# EAGLE design Hviezdy (EAGLE 7.5.0)
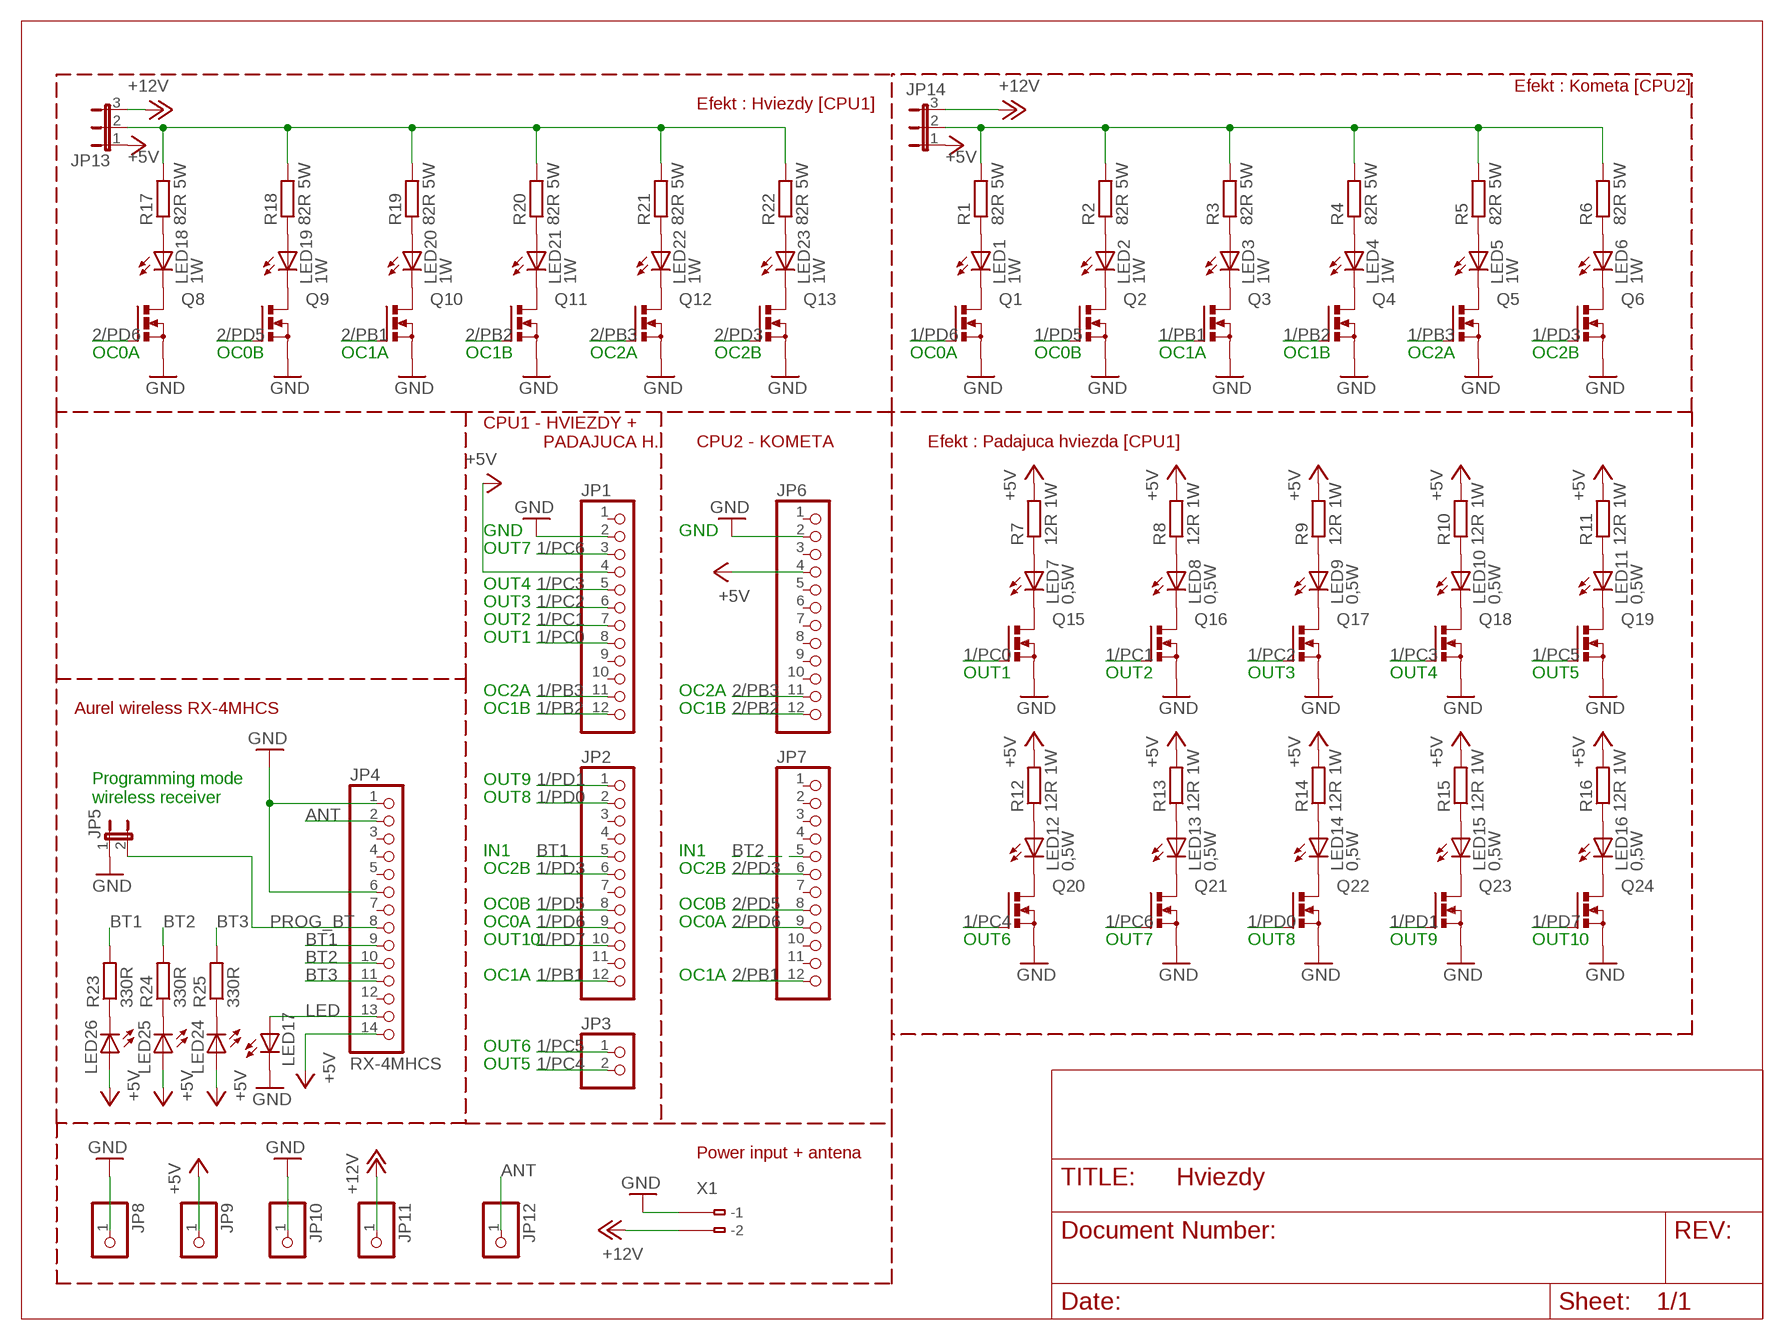
[diagram p0: schematic, sheet 1]

## Parts
JP1  PINHD-1X12  [1X12]
JP2  PINHD-1X12  [1X12]
JP3  PINHD-1X2  [1X02]
JP4  RX-4MHCS  PINHD-1X14  [1X14]
JP5  JP1E  [JP1]
JP6  PINHD-1X12  [1X12]
JP7  PINHD-1X12  [1X12]
JP8  PINHD-1X1  [1X01]
JP9  PINHD-1X1  [1X01]
JP10  PINHD-1X1  [1X01]
JP11  PINHD-1X1  [1X01]
JP12  PINHD-1X1  [1X01]
JP13  JP2E  [JP2]
JP14  JP2E  [JP2]
LED1  1W  LED5MM  [LED5MM]
LED2  1W  LED5MM  [LED5MM]
LED3  1W  LED5MM  [LED5MM]
LED4  1W  LED5MM  [LED5MM]
LED5  1W  LED5MM  [LED5MM]
LED6  1W  LED5MM  [LED5MM]
LED7  0,5W  LED10MM  [LED10MM]
LED8  0,5W  LED10MM  [LED10MM]
LED9  0,5W  LED10MM  [LED10MM]
LED10  0,5W  LED10MM  [LED10MM]
LED11  0,5W  LED10MM  [LED10MM]
LED12  0,5W  LED10MM  [LED10MM]
LED13  0,5W  LED10MM  [LED10MM]
LED14  0,5W  LED10MM  [LED10MM]
LED15  0,5W  LED10MM  [LED10MM]
LED16  0,5W  LED10MM  [LED10MM]
LED17  LED3MM  [LED3MM]
LED18  1W  LED5MM  [LED5MM]
LED19  1W  LED5MM  [LED5MM]
LED20  1W  LED5MM  [LED5MM]
LED21  1W  LED5MM  [LED5MM]
LED22  1W  LED5MM  [LED5MM]
LED23  1W  LED5MM  [LED5MM]
LED24  LED3MM  [LED3MM]
LED25  LED3MM  [LED3MM]
LED26  LED3MM  [LED3MM]
Q1  PMOSFET_NTO220BV  [TO220BV]
Q2  PMOSFET_NTO220BV  [TO220BV]
Q3  PMOSFET_NTO220BV  [TO220BV]
Q4  PMOSFET_NTO220BV  [TO220BV]
Q5  PMOSFET_NTO220BV  [TO220BV]
Q6  PMOSFET_NTO220BV  [TO220BV]
Q8  PMOSFET_NTO220BV  [TO220BV]
Q9  PMOSFET_NTO220BV  [TO220BV]
Q10  PMOSFET_NTO220BV  [TO220BV]
Q11  PMOSFET_NTO220BV  [TO220BV]
Q12  PMOSFET_NTO220BV  [TO220BV]
Q13  PMOSFET_NTO220BV  [TO220BV]
Q15  PMOSFET_NTO220BV  [TO220BV]
Q16  PMOSFET_NTO220BV  [TO220BV]
Q17  PMOSFET_NTO220BV  [TO220BV]
Q18  PMOSFET_NTO220BV  [TO220BV]
Q19  PMOSFET_NTO220BV  [TO220BV]
Q20  PMOSFET_NTO220BV  [TO220BV]
Q21  PMOSFET_NTO220BV  [TO220BV]
Q22  PMOSFET_NTO220BV  [TO220BV]
Q23  PMOSFET_NTO220BV  [TO220BV]
Q24  PMOSFET_NTO220BV  [TO220BV]
R1  82R 5W  R-EU_0922V  [0922V]
R2  82R 5W  R-EU_0922V  [0922V]
R3  82R 5W  R-EU_0922V  [0922V]
R4  82R 5W  R-EU_0922V  [0922V]
R5  82R 5W  R-EU_0922V  [0922V]
R6  82R 5W  R-EU_0922V  [0922V]
R7  12R 1W  R-EU_0309/12  [0309/12]
R8  12R 1W  R-EU_0309/12  [0309/12]
R9  12R 1W  R-EU_0309/12  [0309/12]
R10  12R 1W  R-EU_0309/12  [0309/12]
R11  12R 1W  R-EU_0309/12  [0309/12]
R12  12R 1W  R-EU_0309/12  [0309/12]
R13  12R 1W  R-EU_0309/12  [0309/12]
R14  12R 1W  R-EU_0309/12  [0309/12]
R15  12R 1W  R-EU_0309/12  [0309/12]
R16  12R 1W  R-EU_0309/12  [0309/12]
R17  82R 5W  R-EU_0922V  [0922V]
R18  82R 5W  R-EU_0922V  [0922V]
R19  82R 5W  R-EU_0922V  [0922V]
R20  82R 5W  R-EU_0922V  [0922V]
R21  82R 5W  R-EU_0922V  [0922V]
R22  82R 5W  R-EU_0922V  [0922V]
R23  330R  R-EU_0207/12  [0207/12]
R24  330R  R-EU_0207/12  [0207/12]
R25  330R  R-EU_0207/12  [0207/12]
X1  234-202  [234-202]

## Nets
1/PB1: JP2.12 Q3.G
1/PB2: JP1.12 Q4.G
1/PB3: JP1.11 Q5.G
1/PC0: JP1.8 Q15.G
1/PC1: JP1.7 Q16.G
1/PC2: JP1.6 Q17.G
1/PC3: JP1.5 Q18.G
1/PC4: JP3.2 Q20.G
1/PC5: JP3.1 Q19.G
1/PC6: JP1.3 Q21.G
1/PD0: JP2.2 Q22.G
1/PD1: JP2.1 Q23.G
1/PD3: JP2.6 Q6.G
1/PD5: JP2.8 Q2.G
1/PD6: JP2.9 Q1.G
1/PD7: JP2.10 Q24.G
2/PB1: JP7.12 Q10.G
2/PB2: JP6.12 Q11.G
2/PB3: JP6.11 Q12.G
2/PD3: JP7.6 Q13.G
2/PD5: JP7.8 Q9.G
2/PD6: JP7.9 Q8.G
+5V: JP1.4 JP4.14 JP6.4 JP9.1 JP13.1 JP14.1 LED24.A LED25.A LED26.A R7.2 R8.2 R9.2 R10.2 R11.2 R12.2 R13.2 R14.2 R15.2 R16.2
+12V: JP11.1 JP13.3 JP14.3 X1.B2(B-2)
ANT: JP4.2 JP12.1
BT1: JP2.5 JP4.9 R23.2
BT2: JP4.10 JP7.5 R24.2
BT3: JP4.11 R25.2
GND: JP1.2 JP4.1 JP4.6 JP5.1 JP6.2 JP8.1 JP10.1 LED17.K(C) Q1.S Q2.S Q3.S Q4.S Q5.S Q6.S Q8.S Q9.S Q10.S Q11.S Q12.S Q13.S Q15.S Q16.S Q17.S Q18.S Q19.S Q20.S Q21.S Q22.S Q23.S Q24.S X1.B1(B-1)
LED: JP4.13 LED17.A
N$1: LED1.K(C) Q1.D
N$2: LED2.K(C) Q2.D
N$3: LED3.K(C) Q3.D
N$4: LED4.K(C) Q4.D
N$5: LED5.K(C) Q5.D
N$6: LED6.K(C) Q6.D
N$7: LED1.A R1.1
N$8: LED2.A R2.1
N$9: LED3.A R3.1
N$10: LED4.A R4.1
N$11: LED5.A R5.1
N$12: LED6.A R6.1
N$13: LED7.A R7.1
N$14: LED7.K(C) Q15.D
N$15: LED8.K(C) Q16.D
N$16: LED9.K(C) Q17.D
N$17: LED10.K(C) Q18.D
N$18: LED11.K(C) Q19.D
N$19: LED12.K(C) Q20.D
N$20: LED8.A R8.1
N$21: LED9.A R9.1
N$22: LED10.A R10.1
N$23: LED11.A R11.1
N$24: LED12.A R12.1
N$25: LED13.A R13.1
N$26: LED14.A R14.1
N$27: LED13.K(C) Q21.D
N$28: LED15.A R15.1
N$29: LED14.K(C) Q22.D
N$30: LED16.A R16.1
N$31: LED15.K(C) Q23.D
N$32: LED18.K(C) Q8.D
N$33: LED16.K(C) Q24.D
N$34: LED19.K(C) Q9.D
N$35: LED20.K(C) Q10.D
N$36: LED21.K(C) Q11.D
N$37: LED22.K(C) Q12.D
N$38: LED23.K(C) Q13.D
N$39: LED18.A R17.1
N$40: LED19.A R18.1
N$41: LED20.A R19.1
N$42: LED21.A R20.1
N$43: LED22.A R21.1
N$44: LED23.A R22.1
N$45: LED26.K(C) R23.1
N$46: LED25.K(C) R24.1
N$47: LED24.K(C) R25.1
N$52: JP13.2 R17.2 R18.2 R19.2 R20.2 R21.2 R22.2
N$53: JP14.2 R1.2 R2.2 R3.2 R4.2 R5.2 R6.2
PROG_BT: JP4.8 JP5.2
Unconnected: JP1.1 JP1.9 JP1.10 JP2.3 JP2.4 JP2.7 JP2.11 JP4.3 JP4.4 JP4.5 JP4.7 JP4.12 JP6.1 JP6.3 JP6.5 JP6.6 JP6.7 JP6.8 JP6.9 JP6.10 JP7.1 JP7.2 JP7.3 JP7.4 JP7.7 JP7.10 JP7.11 X1.A1(-1) X1.A2(-2)

## Notes on the sheet
- Efekt : Kometa [CPU2]
- Efekt : Hviezdy [CPU1]
- OC0A | OC0B | OC1A | OC1B | OC2A | OC2B | OC0A | OC0B | OC1A | OC1B | OC2A | OC2B
- CPU1 - HVIEZDY +
              PADAJUCA H.
- CPU2 - KOMETA | Efekt : Padajuca hviezda [CPU1]
- GND | GND
- OUT7
- OUT4
- OUT3
- OUT2
- OUT1
- OUT1 | OUT2 | OUT3 | OUT4 | OUT5
- OC2A | OC2A
- Aurel wireless RX-4MHCS | OC1B | OC1B
- OUT9
- Programming mode
  wireless receiver
- OUT8
- IN1 | IN1
- OC2B | OC2B
- OC0B | OC0B
- OC0A | OC0A
- OUT10 | OUT6 | OUT7 | OUT8 | OUT9 | OUT10
- OC1A | OC1A
- OUT6
- OUT5
- Power input + antena

## Library data of the parts
JP1 JP2 JP6 JP7 = pinhead:PINHD-1X12: PIN HEADER
JP3 = pinhead:PINHD-1X2: PIN HEADER
JP4 = pinhead:PINHD-1X14: PIN HEADER
JP5 = jumper:JP1E: JUMPER
JP8-JP12 = pinhead:PINHD-1X1: PIN HEADER
JP13 JP14 = jumper:JP2E: JUMPER
LED1-LED26 = led:LED: LED OSRAM: - CHIPLED LG R971, LG N971, LY N971, LG Q971, LY Q971, LO R971, LY R971 LH N974, LH R974 LS Q976, LO Q976, LY Q976 LO Q996 - Hyper CHIPLED LW Q18S LB Q993, LB Q99A, LB R99A - SideLED LS A670, LO A670, LY A670, LG A670, LP A670 LB A673, LV A673, LT A673, LW A673 LH A674 LY A675 LS A676, LA A676, LO A676, LY A676, LW A676 LS A679, LY A679, LG A679 - Hyper Micro SIDELED® LS Y876, LA Y876, LO Y876, LY Y876 LT Y87S - SmartLED LW L88C, LW L88S LB L89C, LB L89S, LG L890 LS L89K, LO L89K, LY L89K LS L896, LA L896, LO L896, LY L896 - TOPLED LS T670, LO T670, LY T670, LG T670, LP T670 LSG T670, LSP T670, LSY T670, LOP T670, LYG T670 LG T671, LOG T671, LSG T671 LB T673, LV T673, LT T673, LW T673 LH T674 LS T676, LA T676, LO T676, LY T676, LB T676, LH T676, LSB T676, LW T676 LB T67C, LV T67C, LT T67C, LS T67K, LO T67K, LY T67K, LW E67C LS E67B, LA E67B, LO E67B, LY E67B, LB E67C, LV E67C, LT E67C LW T67C LS T679, LY T679, LG T679 LS T770, LO T770, LY T770, LG T770, LP T770 LB T773, LV T773, LT T773, LW T773 LH T774 LS E675, LA E675, LY E675, LS T675 LS T776, LA T776, LO T776, LY T776, LB T776 LHGB T686 LT T68C, LB T68C - Hyper Mini TOPLED® LB M676 - Mini TOPLED Santana® LG M470 LS M47K, LO M47K, LY M47K Source: http://www.osram.convergy.de LUXEON: - LUMILED® LXK2-PW12-R00, LXK2-PW12-S00, LXK2-PW14-U00, LXK2-PW14-V00 LXK2-PM12-R00, LXK2-PM12-S00, LXK2-PM14-U00 LXK2-PE12-Q00, LXK2-PE12-R00, LXK2-PE12-S00, LXK2-PE14-T00, LXK2-PE14-U00 LXK2-PB12-K00, LXK2-PB12-L00, LXK2-PB12-M00, LXK2-PB14-N00, LXK2-PB14-P00, LXK2-PB14-Q00 LXK2-PR12-L00, LXK2-PR12-M00, LXK2-PR14-Q00, LXK2-PR14-R00 LXK2-PD12-Q00, LXK2-PD12-R00, LXK2-PD12-S00 LXK2-PH12-R00, LXK2-PH12-S00 LXK2-PL12-P00, LXK2-PL12-Q00, LXK2-PL12-R00 Source: www.luxeon.com KINGBRIGHT: KA-3528ASYC Source: www.kingbright.com
Q1-Q6 Q8-Q13 Q15-Q24 = transistor-power:PMOSFET_N: Power MOSFET N-Channel
R1-R22 = rcl:R-EU_: RESISTOR, European symbol
R23-R25 = resistor:R-EU_: RESISTOR, European symbol
X1 = con-wago:234-202: WAGO Cage Clamp; MPN: 234-202; OC_FARNELL: unknown; OC_NEWARK: 28K9091

## Net classes
0 default: width 1.016 mm, drill 1.016 mm, clearance 0.508 mm

## Board
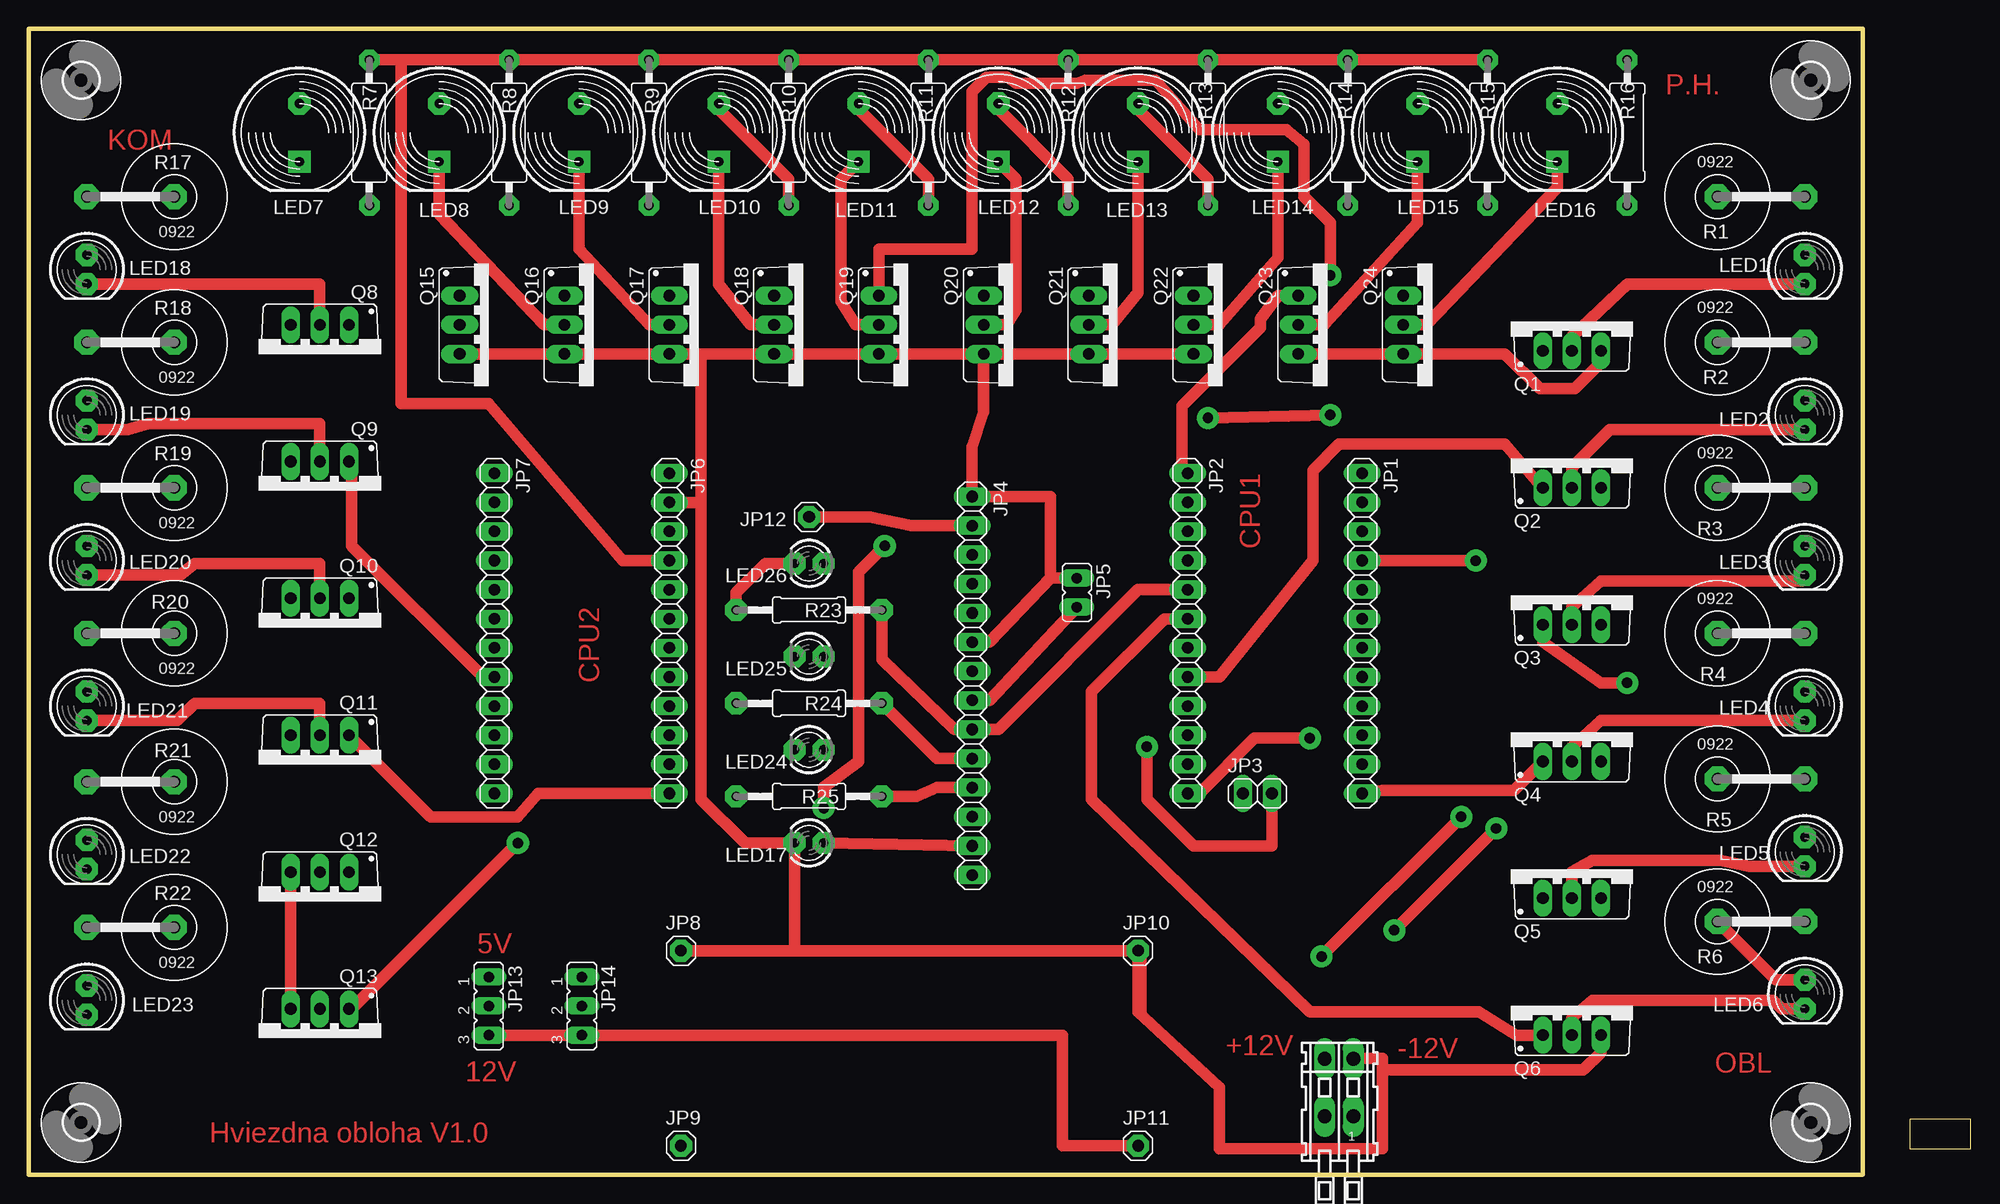
[diagram p1: board, top side]
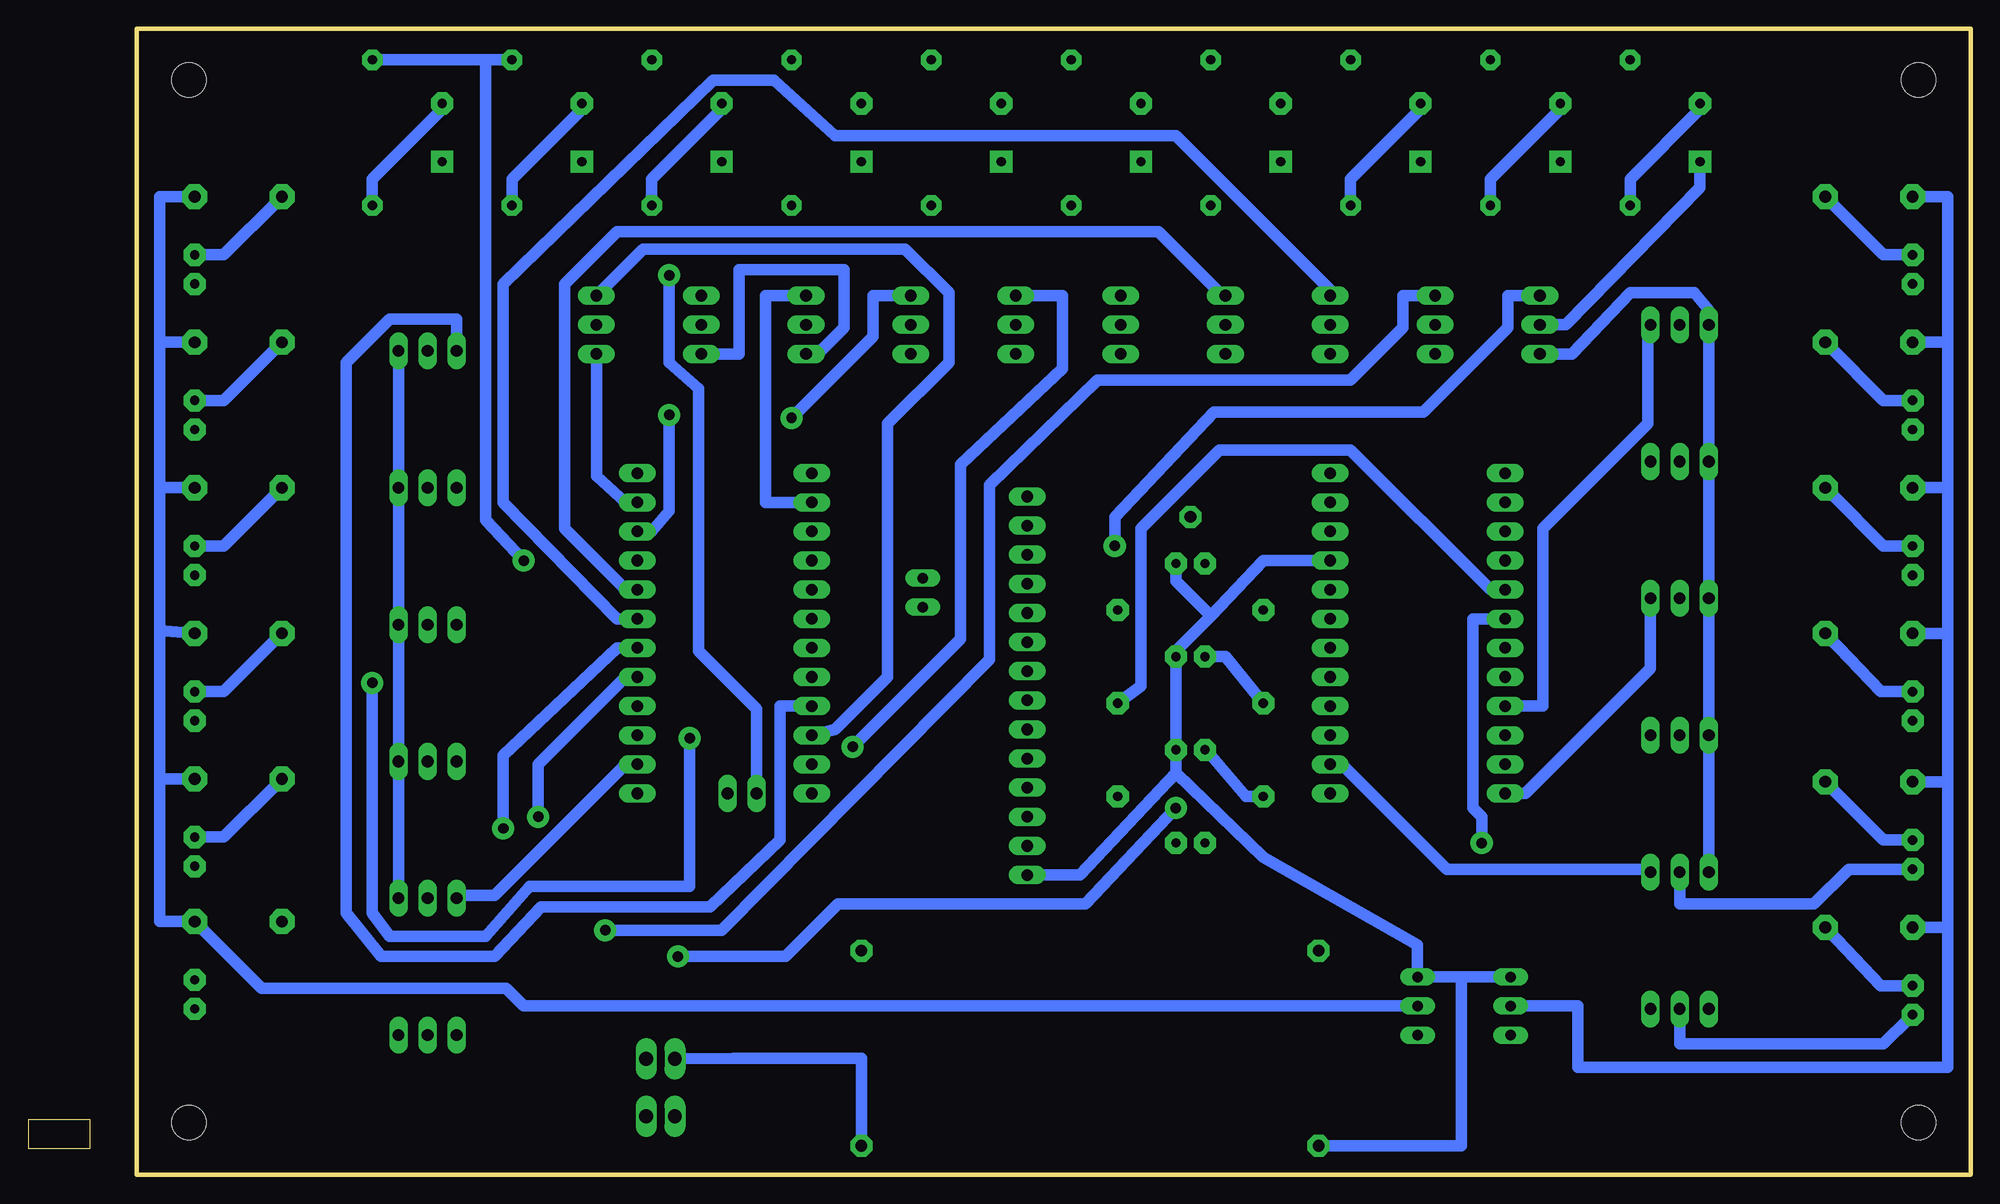
[diagram p2: board, bottom side, seen from below]

Size 169.42 x 100 mm. Coordinates in mm from the lower left corner, seen from the top.
Outline: 0,0 160,0 160,100 0,100 0,0
Copper layers (1*16): Top 0.035mm / dielectric 1.5mm / Bottom 0.035mm
Design rules "default *": minimum track width 10mil, minimum drill 24mil, track to track 8mil, track to pad 8mil, pad to pad 8mil, via to via 8mil, smd to smd 8mil, copper to edge 40mil, drill to drill 8mil, minimum pad ring 12mil, minimum via ring 8mil, stop-mask expansion 4mil, vias tented up to drill 0mil, thermal gap 10mil

### Footprints (pad centres in the part's own frame; a part is rotated, then mirrored left to right if it is on the bottom)
1X12 = drill 1.016 long: 1 -13.97,0; 2 -11.43,0; 3 -8.89,0; 4 -6.35,0; 5 -3.81,0; 6 -1.27,0; 7 1.27,0; 8 3.81,0; 9 6.35,0; 10 8.89,0; 11 11.43,0; 12 13.97,0
1X02 = drill 1.016 long: 1 -1.27,0; 2 1.27,0
1X14 = drill 1.016 long: 1 -16.51,0; 2 -13.97,0; 3 -11.43,0; 4 -8.89,0; 5 -6.35,0; 6 -3.81,0; 7 -1.27,0; 8 1.27,0; 9 3.81,0; 10 6.35,0; 11 8.89,0; 12 11.43,0; 13 13.97,0; 14 16.51,0
JP1 = drill 0.914 long: 1 0,-1.27; 2 0,1.27
1X01 = drill 1.016 pad 1.93 octagon: 1 0,0
JP2 = drill 0.914 long: 1 -2.54,0; 2 0,0; 3 2.54,0
LED5MM = drill 0.813 pad 1.93 octagon: A -1.27,0; K 1.27,0
LED10MM = drill 0.813 pad 1.93 octagon: A -2.54,0 | drill 0.813 pad 1.93 square: K 2.54,0
LED3MM = drill 0.813 pad 1.93 octagon: A -1.27,0; K 1.27,0
TO220BV = drill 1.016 long: D 0,-2.54; G -2.54,-2.54; S 2.54,-2.54
0922V = drill 1.016 pad 2.184 octagon: 1 -5.08,0; 2 2.54,0
0309/12 = drill 0.813 pad 1.778 octagon: 1 -6.35,0; 2 6.35,0
0207/12 = drill 0.813 pad 1.93 octagon: 1 -6.35,0; 2 6.35,0
3,0 = hole 3: 0,0
234-202 = drill 1.2 long: A1 -1.25,2.5; A2 1.25,2.5; B1 -1.25,-2.5; B2 1.25,-2.5

### Placement (x,y rotation side)
JP1  116.33,47.24 270 top
JP2  101.09,47.24 270 top
JP3  107.19,33.27 0 top
JP4  82.3,42.67 270 top
JP5  91.44,50.8 180 top
JP6  55.88,47.24 270 top
JP7  40.64,47.24 270 top
JP8  56.9,19.56 0 top
JP9  56.9,2.54 0 top
JP10  96.77,19.56 0 top
JP11  96.77,2.54 0 top
JP12  68.07,57.4 180 top
JP13  40.13,14.73 270 top
JP14  48.26,14.73 270 top
LED1  154.94,78.99 270 top
LED2  154.94,66.29 270 top
LED3  154.94,53.59 270 top
LED4  154.94,40.89 270 top
LED5  154.94,28.19 270 top
LED6  154.94,15.75 270 top
LED7  23.62,90.93 270 top
LED8  35.81,90.93 270 top
LED9  48.01,90.93 270 top
LED10  60.2,90.93 270 top
LED11  72.39,90.93 270 top
LED12  84.58,90.93 270 top
LED13  96.77,90.93 270 top
LED14  108.97,90.93 270 top
LED15  121.16,90.93 270 top
LED16  133.35,90.93 270 top
LED17  68.07,28.96 180 top
LED18  5.08,78.99 270 top
LED19  5.08,66.29 270 top
LED20  5.08,53.59 270 top
LED21  5.08,40.89 270 top
LED22  5.08,27.94 270 top
LED23  5.08,15.24 270 top
LED24  68.07,37.08 180 top
LED25  68.07,45.21 180 top
LED26  68.07,53.34 180 top
Q1  134.62,74.42 0 top
Q2  134.62,62.48 0 top
Q3  134.62,50.55 0 top
Q4  134.62,38.61 0 top
Q5  134.62,26.67 0 top
Q6  134.62,14.73 0 top
Q8  25.4,71.63 180 top
Q9  25.4,59.69 180 top
Q10  25.4,47.75 180 top
Q11  25.4,35.81 180 top
Q12  25.4,23.88 180 top
Q13  25.4,11.94 180 top
Q15  40.13,74.17 270 top
Q16  49.28,74.17 270 top
Q17  58.42,74.17 270 top
Q18  67.56,74.17 270 top
Q19  76.71,74.17 270 top
Q20  85.85,74.17 270 top
Q21  95,74.17 270 top
Q22  104.14,74.17 270 top
Q23  113.28,74.17 270 top
Q24  122.43,74.17 270 top
R1  152.4,85.34 0 top
R2  152.4,72.64 0 top
R3  152.4,59.94 0 top
R4  152.4,47.24 0 top
R5  152.4,34.54 0 top
R6  152.4,22.1 0 top
R7  29.72,90.93 90 top
R8  41.91,90.93 90 top
R9  54.1,90.93 90 top
R10  66.29,90.93 90 top
R11  78.49,90.93 90 top
R12  90.68,90.93 90 top
R13  102.87,90.93 90 top
R14  115.06,90.93 90 top
R15  127.25,90.93 90 top
R16  139.45,90.93 90 top
R17  7.62,85.34 180 top
R18  7.62,72.64 180 top
R19  7.62,59.94 180 top
R20  7.62,47.24 180 top
R21  7.62,34.29 180 top
R22  7.62,21.59 180 top
R23  68.07,49.28 0 top
R24  68.07,41.15 0 top
R25  68.07,33.02 0 top
U$1  [3,0]  4.57,4.57 0 top
U$2  [3,0]  4.57,95.5 0 top
U$3  [3,0]  155.45,95.5 0 top
U$4  [3,0]  155.45,4.57 0 top
X1  114.3,7.62 180 top

### Tracks (layer width: path | path; a pad name or v marks a point on that pad's centre or on a via)
1/PB1  (via drill 0.91 pad 1.93)
  Top 1.016: v139.45,42.93 137.16,42.93 132.08,46.48 Q3.G | v111.76,38.1 106.93,38.1 102.11,33.27 JP2.12
  Bottom 1.016: v111.76,38.1 111.76,25.15 125.73,25.15 129.54,20.83 137.92,20.83 139.45,22.86 139.45,25.91 139.45,26.42 139.45,33.27 139.45,34.29 v139.45,42.93
1/PB2
  Top 1.016: JP1.12 118.11,33.53 129.54,33.53 131.83,35.81 Q4.G
1/PB3
  Bottom 1.016: Q5.G 131.83,24.38 128.78,24.38 117.35,35.81 116.59,35.81 JP1.11
1/PC0  (via drill 0.91 pad 1.93)
  Top 1.016: v112.78,19.05 v124.97,31.24 | v69.34,32 69.34,33.78 72.39,36.07 72.39,52.58 v74.68,54.86
  Bottom 1.016: v124.97,31.24 124.97,35.81 117.35,43.43 116.59,43.43 JP1.8 | v112.78,19.05 103.38,19.05 98.81,23.62 77.22,23.62 v69.34,32 | v74.68,54.86 74.68,57.4 66.04,66.55 47.75,66.55 40.39,73.91 40.39,75.44 40.39,76.71 38.1,76.71 Q15.G
1/PC1  (via drill 0.91 pad 1.93)
  Top 1.016: v119.13,21.34 v128.02,30.23
  Bottom 1.016: v128.02,30.23 128.02,36.58 118.11,45.97 116.59,45.97 JP1.7 | v119.13,21.34 108.97,21.34 85.6,44.96 85.6,60.2 76.2,69.34 54.1,69.34 49.53,73.91 49.53,75.44 49.53,76.71 47.24,76.71 Q16.G
1/PC2
  Bottom 1.016: JP1.6 116.59,48.51 118.11,48.51 128.02,58.67 128.02,77.72 109.73,95.5 104.39,95.5 99.06,90.68 69.34,90.68 55.63,76.96 Q17.G
1/PC3
  Bottom 1.016: JP1.5 116.59,51.05 117.35,51.05 122.68,56.39 122.68,77.72 118.11,82.3 70.87,82.3 65.53,76.96 Q18.G
1/PC4  (via drill 0.91 pad 1.93)
  Top 1.016: v97.54,37.34 97.54,32.77 101.6,28.7 108.46,28.7 108.46,33.02 JP3.2
  Bottom 1.016: v97.54,37.34 88.14,46.74 88.14,61.98 79.25,70.36 79.25,71.12 79.25,75.44 79.25,76.71 Q20.G
1/PC5  (via drill 0.91 pad 1.93)
  Top 1.016: v113.54,78.49 113.54,83.06 111.25,85.34 111.25,89.92 109.73,91.19 102.11,91.19 98.3,95.5 92.2,95.5 91.44,95.25 86.11,95.25 85.34,95.76 83.57,95.76 82.3,94.49 82.3,80.77 76.45,80.77 74.17,80.77 Q19.G
  Bottom 1.016: JP3.1 105.92,40.64 111,45.72 111,68.58 113.54,70.87 v113.54,78.49
1/PC6  (via drill 0.91 pad 1.93)
  Top 1.016: v102.87,66.04 v113.54,66.29
  Bottom 1.016: v113.54,66.29 113.54,57.91 115.06,56.13 115.82,56.13 JP1.3 | v102.87,66.04 95.76,73.15 95.76,75.44 95.76,76.71 92.96,76.71 Q21.G
1/PD0
  Bottom 1.016: JP2.2 105.16,58.67 105.16,61.72 105.16,76.71 103.63,76.71 Q22.G
1/PD1
  Top 1.016: JP2.1 100.58,61.72 100.58,67.06 107.44,73.91 107.44,74.68 108.97,76.71 110.49,76.71 Q23.G
1/PD3
  Top 1.016: JP2.6 99.06,48.51 92.71,42.16 92.71,32.77 111.76,14.22 126.49,14.22 129.79,12.19 Q6.G
1/PD5
  Top 1.016: JP2.8 103.89,43.43 112.01,53.59 112.01,61.47 114.3,63.75 128.78,63.75 131.83,60.2 Q2.G
1/PD6
  Bottom 1.016: JP2.9 100.84,40.89 102.36,40.89 103.89,40.89 103.89,29.21 109.98,23.37 124.71,23.37 128.78,19.05 138.68,19.05 141.73,22.86 141.73,70.87 137.92,74.68 132.08,74.68 132.08,73.91 132.08,72.39 Q1.G
1/PD7
  Bottom 1.016: JP2.10 99.06,38.86 94.49,43.43 94.49,65.53 89.15,70.87 89.15,76.96 92.96,80.77 115.82,80.77 119.63,76.96 Q24.G
2/PB1
  Bottom 1.016: Q10.G 27.94,44.2 38.86,33.27 40.39,33.27 JP7.12
2/PB2
  Top 1.016: JP6.12 44.45,33.27 42.67,31.24 35.05,31.24 28.19,38.1 Q11.G
2/PB3
  Bottom 1.016: Q12.G 28.19,26.67 45.72,26.67 54.86,35.81 55.63,35.81 JP6.11
2/PD3  (via drill 0.91 pad 1.93)
  Top 1.016: v42.67,28.96 28.19,14.48 Q13.G
  Bottom 1.016: v42.67,28.96 42.67,31.24 43.43,32 43.43,47.24 43.43,48.51 41.91,48.51 JP7.6
2/PD5
  Top 1.016: Q9.G 28.19,61.72 28.19,54.86 39.62,43.43 40.39,43.43 JP7.8
2/PD6
  Bottom 1.016: Q8.G 28.19,73.91 28.19,65.53 37.34,56.39 37.34,42.67 37.34,40.89 40.13,40.89 JP7.9
+5V  (via drill 0.91 pad 1.93)
  Top 1.016: v126.24,53.59 118.36,53.59 JP1.4 | 32.51,97.28 R8.2 53.85,97.28 | 32.51,97.28 29.97,97.28 R7.2 | 53.85,97.28 R9.2 53.85,97.28 | 53.85,97.28 R10.2 R11.2 R12.2 102.62,97.28 | 102.62,97.28 R13.2 102.62,97.28 | 102.62,97.28 R14.2 R15.2 | 32.51,97.28 32.51,71.63 32.51,67.31 40.13,67.31 51.82,53.59 55.63,53.59 JP6.4
  Bottom 1.016: v126.24,53.59 129.54,57.15 129.54,94.49 | 129.54,97.28 129.54,94.49 | 129.54,97.28 R15.2 | 129.54,97.28 R16.2 | 129.54,94.49 129.54,97.28 | 66.29,48.77 69.34,45.72 LED25.A 69.34,44.96 69.34,37.34 LED24.A 69.34,36.58 69.34,35.05 | 66.29,48.77 61.72,53.59 56.39,53.59 JP6.4 | LED26.A 69.34,51.82 66.29,48.77 | JP4.14 77.72,26.16 69.34,35.05 | JP14.1 48.26,20.07 61.72,27.69 69.34,35.05 | 44.45,2.54 JP9.1 44.45,2.54 | 44.45,2.54 44.45,17.27 | 44.45,17.27 JP14.1 | 44.45,2.54 44.45,17.27 | 44.45,17.27 JP14.1 | JP14.1 44.45,17.27 | JP13.1 44.45,17.27
+12V
  Top 1.016: JP14.3 62.74,12.19 90.17,12.19 | 96.52,2.54 90.17,2.54 | 90.17,2.54 90.17,12.19 | JP11.1 90.17,2.54 | 90.17,2.54 90.17,12.19 | JP14.3 JP13.3 JP14.3
  Bottom 1.016: 96.77,10.16 107.95,10.16 X1.B2 113.03,10.16 | 96.77,10.16 JP11.1 96.77,10.16
ANT
  Top 1.016: JP12.1 73.41,57.4 76.96,56.64 JP4.2
BT1
  Top 1.016: R23.2 74.42,48.77 74.42,44.96 80.77,38.86 JP4.9 84.58,38.86 96.77,51.05 JP2.5
BT2
  Top 1.016: JP4.10 79.25,36.32 R24.2
  Bottom 1.016: R24.2 72.39,42.67 72.39,56.39 65.53,63.25 54.1,63.25 41.91,51.05 41.15,51.05 JP7.5
BT3
  Top 1.016: R25.2 77.47,33.02 79.25,33.78 JP4.11
GND
  Top 1.016: Q23.S 111.25,71.63 119.63,71.63 Q24.S 120.4,71.63 128.78,71.63 131.83,68.58 134.87,68.58 137.16,70.87 137.16,71.63 Q1.S | Q13.S 22.86,25.91 Q12.S | 89.15,52.07 JP5.1 | 89.15,52.07 83.82,46.48 JP4.6 | Q22.S 101.35,71.63 92.96,71.63 Q21.S 92.2,71.63 83.82,71.63 Q20.S | Q20.S 83.06,71.63 Q20.S | Q20.S 74.68,71.63 Q19.S 73.91,71.63 65.53,71.63 Q18.S 64.77,71.63 60.96,71.63 58.67,71.63 | Q20.S 83.31,66.55 82.3,63.5 JP4.1 | JP4.1 82.3,59.44 JP4.1 | 89.15,52.07 89.15,53.34 89.15,58.42 89.15,59.18 JP4.1 | Q6.S 137.16,10.67 135.64,9.14 118.11,9.14 | 118.11,9.14 118.11,10.16 115.57,10.16 X1.B1 | 118.11,9.14 118.11,3.81 118.11,2.29 103.89,2.29 103.89,7.62 96.77,14.22 JP10.1 | 66.8,19.56 66.8,25.15 LED17.K 62.48,28.96 58.67,32.77 58.67,57.15 58.67,58.67 | Q15.S 38.1,71.63 46.48,71.63 Q16.S 47.24,71.63 55.63,71.63 Q17.S 56.39,71.63 58.67,71.63 | 58.67,58.67 56.39,58.67 JP6.2 58.67,58.67 | 58.67,58.67 58.67,60.2 58.67,71.63 | JP8.1 66.8,19.56 | JP10.1 97.03,19.56 97.03,14.22 | JP8.1 66.8,19.56 | JP10.1 66.8,19.56 | 66.8,19.56 JP8.1
  Bottom 1.016: Q24.S 119.89,60.96 117.35,58.67 116.59,58.67 JP1.2 | Q5.S 137.16,24.38 137.16,35.81 Q4.S 137.16,36.58 Q3.S 137.16,59.44 Q2.S 137.16,60.2 137.16,71.63 Q1.S | Q12.S 22.86,26.67 22.86,38.1 Q11.S 22.86,38.86 Q10.S 22.86,61.72 Q9.S 22.86,62.48 22.86,73.91 Q8.S 22.86,74.68 22.86,75.44 24.13,76.96 29.72,76.96 34.8,71.63 37.34,71.63 Q15.S | Q23.S 110.49,71.63 107.44,71.63 107.44,72.14 107.44,78.99 98.3,78.99 98.3,76.96 98.3,73.91 100.58,71.63 101.35,71.63 Q22.S
LED
  Top 1.016: LED17.A JP4.13
N$1
  Top 1.016: Q1.D 134.62,72.39 134.62,73.15 139.45,77.72 154.69,77.72 LED1.K
N$2
  Top 1.016: Q2.D 134.62,60.2 134.62,61.72 137.92,65.02 154.69,65.02 LED2.K
N$3
  Top 1.016: Q3.D 134.62,49.53 137.16,51.82 154.69,51.82 LED3.K
N$4
  Top 1.016: Q4.D 134.62,36.58 134.62,37.34 137.16,39.62 154.69,39.62 LED4.K
N$5
  Top 1.016: Q5.D 134.62,24.38 134.62,26.42 136.4,27.43 147.57,27.43 150.11,26.92 LED5.K
N$6
  Top 1.016: Q6.D 134.62,13.72 136.4,15.24 152.15,15.24 152.91,14.48 154.69,14.48 LED6.K
N$7
  Bottom 1.016: LED1.A 154.69,80.26 152.4,80.26 147.57,85.09 R1.1
N$8
  Bottom 1.016: LED2.A 154.69,67.56 152.4,67.56 147.57,72.39 R2.1
N$9
  Bottom 1.016: LED3.A 154.69,54.86 152.4,54.86 147.83,59.44 R3.1
N$10
  Bottom 1.016: LED4.A 154.69,42.16 152.4,42.16 147.83,46.74 R4.1
N$11
  Bottom 1.016: LED5.A 154.69,29.46 152.4,29.46 147.57,34.29 R5.1
N$12
  Top 1.016: LED6.A 154.69,17.02 152.4,17.02 147.57,21.84 R6.1
N$13
  Bottom 1.016: R7.1 29.72,86.87 23.62,92.96 LED7.A
N$14
  Bottom 1.016: Q15.D 35.31,74.17 23.62,86.11 LED7.K
N$15
  Top 1.016: LED8.K 35.81,83.82 44.96,74.17 46.48,74.17 Q16.D
N$16
  Top 1.016: LED9.K 48.01,80.77 54.1,74.17 55.63,74.17 Q17.D
N$17
  Top 1.016: LED10.K 60.2,77.72 62.99,74.17 64.52,74.17 Q18.D
N$18
  Top 1.016: LED11.K 70.87,86.87 70.87,76.2 72.14,74.17 73.66,74.17 Q19.D
N$19
  Top 1.016: LED12.K 86.11,86.87 86.11,75.44 85.34,74.17 83.82,74.17 Q20.D
N$20
  Bottom 1.016: R8.1 41.91,86.87 35.81,92.96 LED8.A
N$21
  Bottom 1.016: R9.1 54.1,86.87 48.01,92.96 LED9.A
N$22
  Top 1.016: R10.1 66.29,86.87 60.2,92.96 LED10.A
N$23
  Top 1.016: R11.1 78.49,86.87 72.39,92.96 LED11.A
N$24
  Top 1.016: R12.1 90.68,86.87 84.58,92.96 LED12.A
N$25
  Top 1.016: R13.1 102.87,86.87 96.77,92.96 LED13.A
N$26
  Bottom 1.016: R14.1 115.06,86.87 108.97,92.96 LED14.A
N$27
  Top 1.016: LED13.K 96.77,76.96 94.49,74.17 92.96,74.17 Q21.D
N$28
  Bottom 1.016: R15.1 127.25,86.87 121.16,92.96 LED15.A
N$29
  Top 1.016: LED14.K 108.97,80.01 103.89,74.17 102.36,74.17 Q22.D
N$30
  Bottom 1.016: R16.1 139.45,86.87 133.35,92.96 LED16.A
N$31
  Top 1.016: LED15.K 121.16,83.06 113.03,74.17 111.51,74.17 Q23.D
N$32
  Top 1.016: Q8.D 25.4,77.72 22.86,77.72 5.33,77.72 LED18.K
N$33
  Top 1.016: LED16.K 133.35,86.11 121.92,74.17 120.4,74.17 Q24.D
N$34
  Top 1.016: Q9.D 25.4,62.48 25.4,65.53 10.41,65.53 8.64,65.02 LED19.K
N$35
  Top 1.016: Q10.D 25.4,53.34 23.62,53.34 14.48,53.34 13.21,52.32 LED20.K
N$36
  Top 1.016: Q11.D 25.4,39.37 25.4,41.15 14.48,41.15 12.95,39.62 5.33,39.62 LED21.K
N$37
  Bottom 1.016: Q12.D 25.4,23.62 23.62,23.62 13.72,23.62 10.67,26.67 5.33,26.67 LED22.K
N$38
  Bottom 1.016: Q13.D 25.4,11.43 23.62,11.43 7.62,11.43 5.33,13.72 LED23.K
N$39
  Bottom 1.016: LED18.A 5.33,80.26 7.62,80.26 12.45,85.09 R17.1
N$40
  Bottom 1.016: LED19.A 5.33,67.56 7.62,67.56 12.45,72.39 R18.1
N$41
  Bottom 1.016: LED20.A 5.33,54.86 7.62,54.86 12.19,59.44 R19.1
N$42
  Bottom 1.016: LED21.A 5.33,42.16 7.87,42.16 12.45,46.99 R20.1
N$43
  Bottom 1.016: LED22.A 5.33,29.21 7.62,29.21 12.45,34.04 R21.1
N$44
  Bottom 1.016: LED23.A 5.33,16.51 7.87,16.51 12.45,21.34 R22.1
N$45
  Top 1.016: R23.1 61.72,50.8 64.26,53.34 66.29,53.34 LED26.K
N$46
  Bottom 1.016: R24.1 65.02,45.21 LED25.K
N$47
  Bottom 1.016: R25.1 63.25,33.02 66.29,36.58 LED24.K
N$48  (via drill 0.6 pad 1.93)
  other vias: 4.57,95.5
N$49  (via drill 0.6 pad 1.93)
  other vias: 4.57,4.57
N$50  (via drill 0.6 pad 1.93)
  other vias: 155.45,4.57
N$51  (via drill 0.6 pad 1.93)
  other vias: 155.45,95.5
N$52
  Bottom 1.016: JP13.2 34.29,14.73 34.29,9.4 2.03,9.4 2.03,21.59 | 2.03,21.59 R22.2 2.03,21.59 | 2.03,21.59 2.03,34.29 | 2.03,34.29 R21.2 2.03,34.29 | 2.03,34.29 2.03,47.24 | 2.03,47.24 R20.2 2.03,47.24 | 2.03,47.24 2.03,59.94 | 2.03,59.94 R19.2 2.03,59.94 | 2.03,59.94 2.03,72.64 | 2.03,72.64 R18.2 2.03,72.64 | 2.03,72.64 2.03,85.34 R17.2
N$53
  Bottom 1.016: JP14.2 126.24,14.73 127.76,16.26 149.1,16.26 R6.2 157.99,22.1 157.99,34.54 | 157.99,34.54 R5.2 157.99,34.54 | 157.99,34.54 157.99,47.5 | 157.99,47.5 R4.2 157.99,47.5 | 157.99,47.5 157.99,59.94 | 157.99,59.94 R3.2 157.99,59.94 | 157.99,59.94 157.99,72.64 | 157.99,72.64 R2.2 157.99,72.64 | 157.99,72.64 157.99,85.34 R1.2
PROG_BT
  Top 1.016: JP5.2 83.82,41.4 JP4.8

### Text on the board
Top: P.H. | KOM | CPU1 | CPU2 | 5V | +12V | -12V | OBL | 12V | Hviezdna obloha V1.0